# EAGLE design sensors (EAGLE 8.1.0)
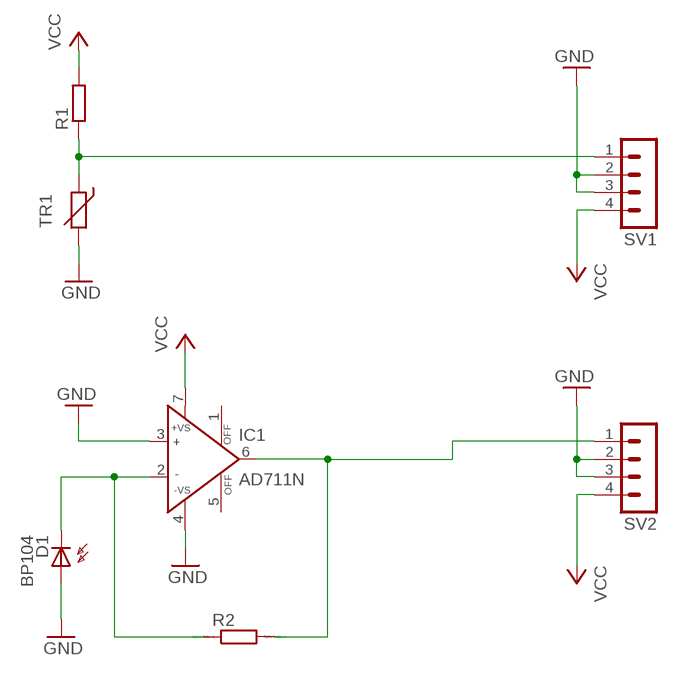
[diagram p0: schematic, sheet 1]

## Parts
D1  BP104  [BP104]
IC1  AD711N  [DIL08]
R1  R-EU_0204/7  [0204/7]
R2  R0204/7  [0204/7]
SV1  MA04-1  [MA04-1]
SV2  MA04-1  [MA04-1]
TR1  THERMISTOR_  [TO92]

## Nets
GND: D1.A IC1.3(IN+) IC1.4(-VS) SV1.2 SV1.3 SV2.2 SV2.3 TR1.2
N$1: R1.1 SV1.1 TR1.1
N$2: D1.K(C) IC1.2(IN-) R2.1
N$3: IC1.6(OUT) R2.2 SV2.1
VCC: IC1.7(+VS) R1.2 SV1.4 SV2.4
Unconnected: IC1.1(OFF) IC1.5(OFF)

## Library data of the parts
D1 = opto-trans-siemens:BP104: PHOTO DIODE; MF: VISHAY/TELEFUNKEN; MPN: BP104; OC_FARNELL: 1779636; OC_NEWARK: 14M4504
IC1 = analog-devices:AD711: Precision, Low Cost, High Speed, BiFET Op Amp Source: http://www.analog.com/static/imported-files/data_sheets/AD711.pdf; MPN: AD711BQ; OC_FARNELL: 9604839; OC_NEWARK: 66F5826
R1 = rcl:R-EU_: RESISTOR, European symbol
R2 = eagle-ltspice:R: RESISTOR, European symbol; SPICEMODEL: NONE; SPICEPREFIX: R
SV1 SV2 = con-lstb:MA04-1: PIN HEADER; OC_FARNELL: unknown; OC_NEWARK: unknown
TR1 = myLib:THERMISTOR_: Thermo Resistor

## Board
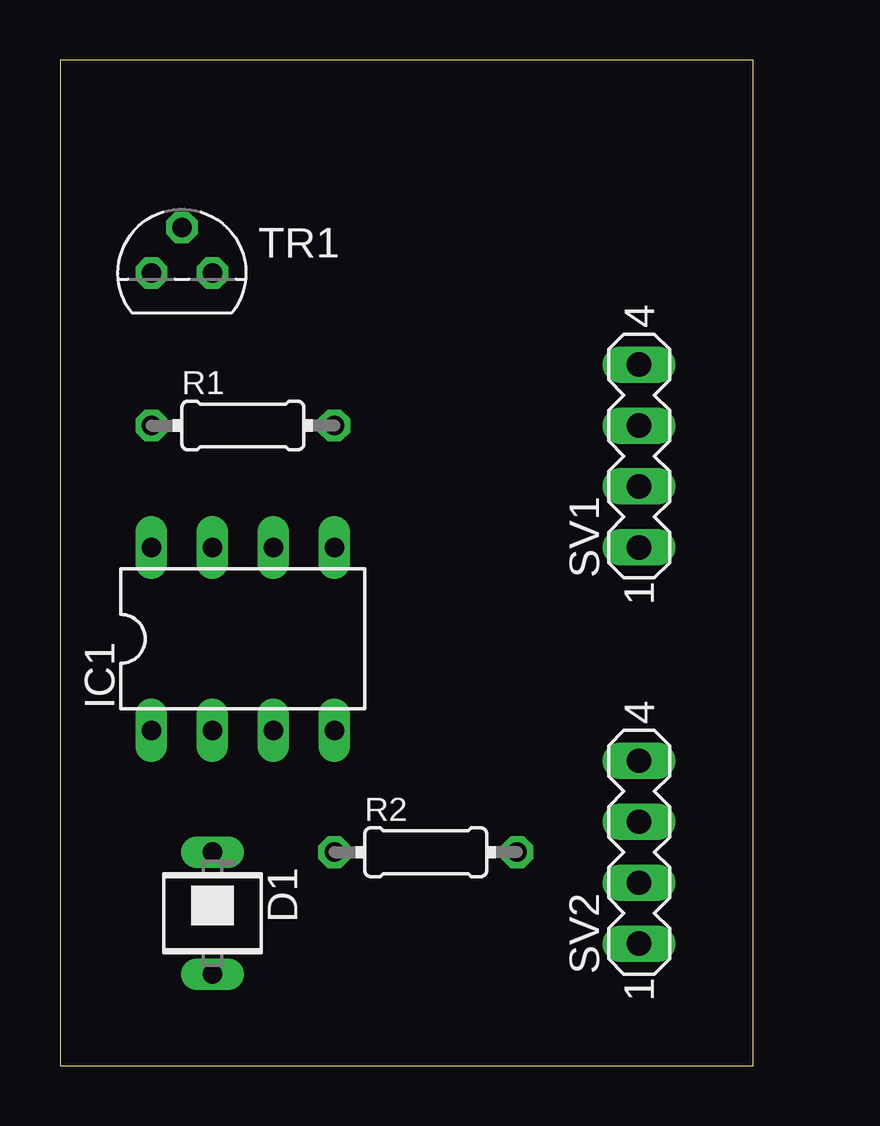
[diagram p1: board, top side]
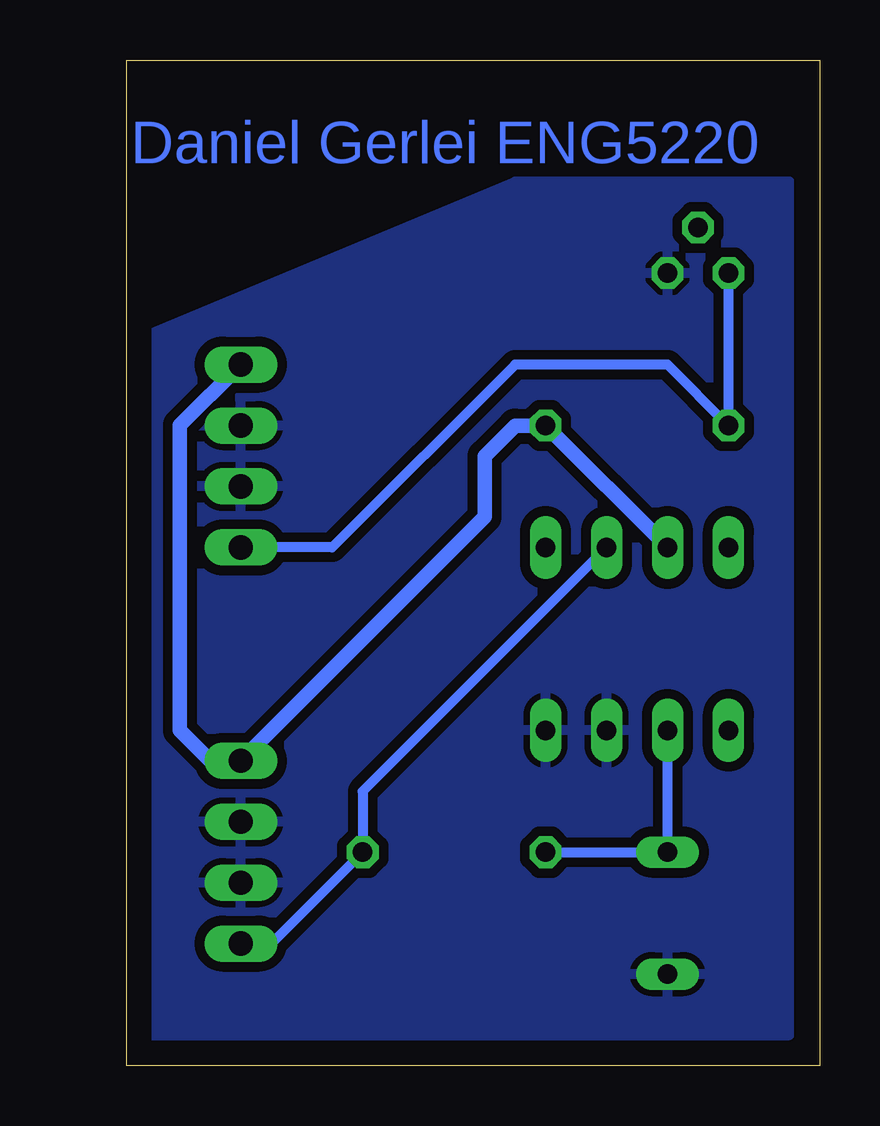
[diagram p2: board, bottom side, seen from below]

Size 28.88 x 41.9 mm. Coordinates in mm from the lower left corner, seen from the top.
Outline: 0,0 28.88,0 28.88,41.9 0,41.9 0,0
Copper layers (1*16): Top 0.035mm / dielectric 1.5mm / Bottom 0.035mm
Design rules "default": minimum track width 10mil, minimum drill 24mil, track to track 8mil, track to pad 8mil, pad to pad 8mil, via to via 8mil, smd to smd 8mil, copper to edge 40mil, drill to drill 8mil, minimum pad ring 10mil, minimum via ring 8mil, stop-mask expansion 4mil, vias tented up to drill 0mil, thermal gap 10mil

### Footprints (pad centres in the part's own frame; a part is rotated, then mirrored left to right if it is on the bottom)
BP104 = drill 0.813 long: A 0,2.54; K 0,-2.54
DIL08 = drill 0.813 long: 1 -3.81,-3.81; 2 -1.27,-3.81; 3 1.27,-3.81; 4 3.81,-3.81; 5 3.81,3.81; 6 1.27,3.81; 7 -1.27,3.81; 8 -3.81,3.81
0204/7 = drill 0.813 octagon: 1 -3.81,0; 2 3.81,0
MA04-1 = drill 1.016 long: 1 -3.81,0; 2 -1.27,0; 3 1.27,0; 4 3.81,0
TO92 = drill 0.813 octagon: 1 -1.27,0; 2 1.27,0; NC 0,1.905

### Placement (x,y rotation side)
D1  6.35,6.35 180 top
IC1  7.62,17.78 0 top
R1  7.62,26.67 0 top
R2  15.24,8.89 0 top
SV1  24.13,25.4 90 top
SV2  24.13,8.89 90 top
TR1  5.08,33.02 0 top

### Tracks (layer width: path | path; a pad name or v marks a point on that pad's centre or on a via)
GND
  pour Bottom (isolate 0.406): 1.27,36.83 12.7,36.83 27.94,30.48 27.94,1.27 1.27,1.27
N$1
  Bottom 0.406: TR1.1 R1.1 6.35,29.21 12.7,29.21 20.32,21.59 SV1.1
N$2
  Bottom 0.406: R2.1 D1.K IC1.2
N$3
  Bottom 0.406: IC1.6 19.05,11.43 R2.2 22.86,5.08 SV2.1
VCC
  Bottom 0.61: IC1.7 R1.2 12.7,26.67 13.97,25.4 13.97,22.86 SV2.4 25.4,12.7 26.67,13.97 26.67,26.69 25.42,27.94 25.4,27.94 SV1.4

### Text on the board
Bottom: Daniel Gerlei ENG5220